# Altium schematic sheet ControL_24_LED_thuong_mai.SchDoc
size C
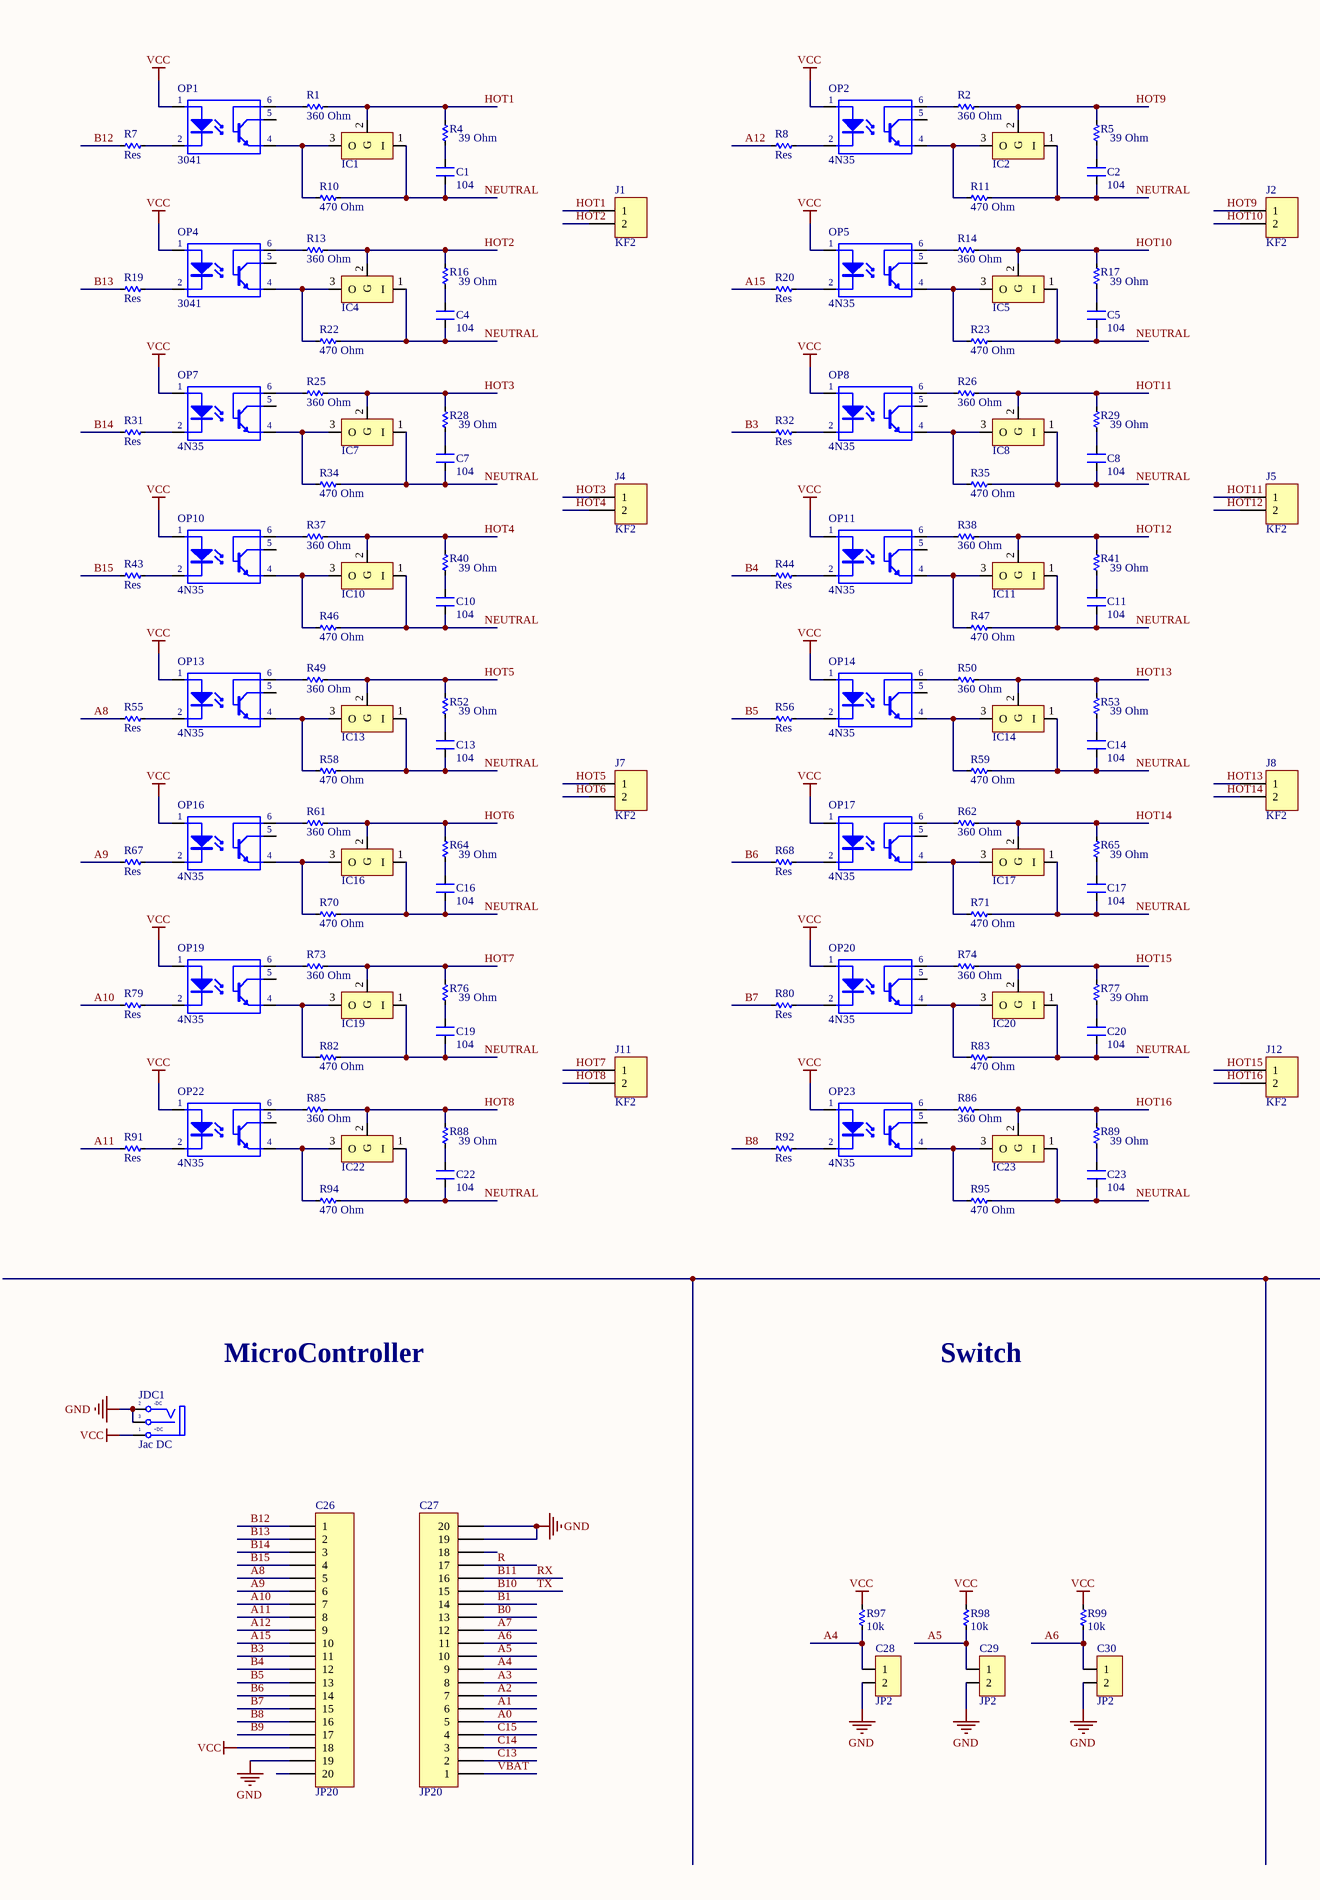
[diagram p0: ControL_24_LED_thuong_mai.SchDoc, left]
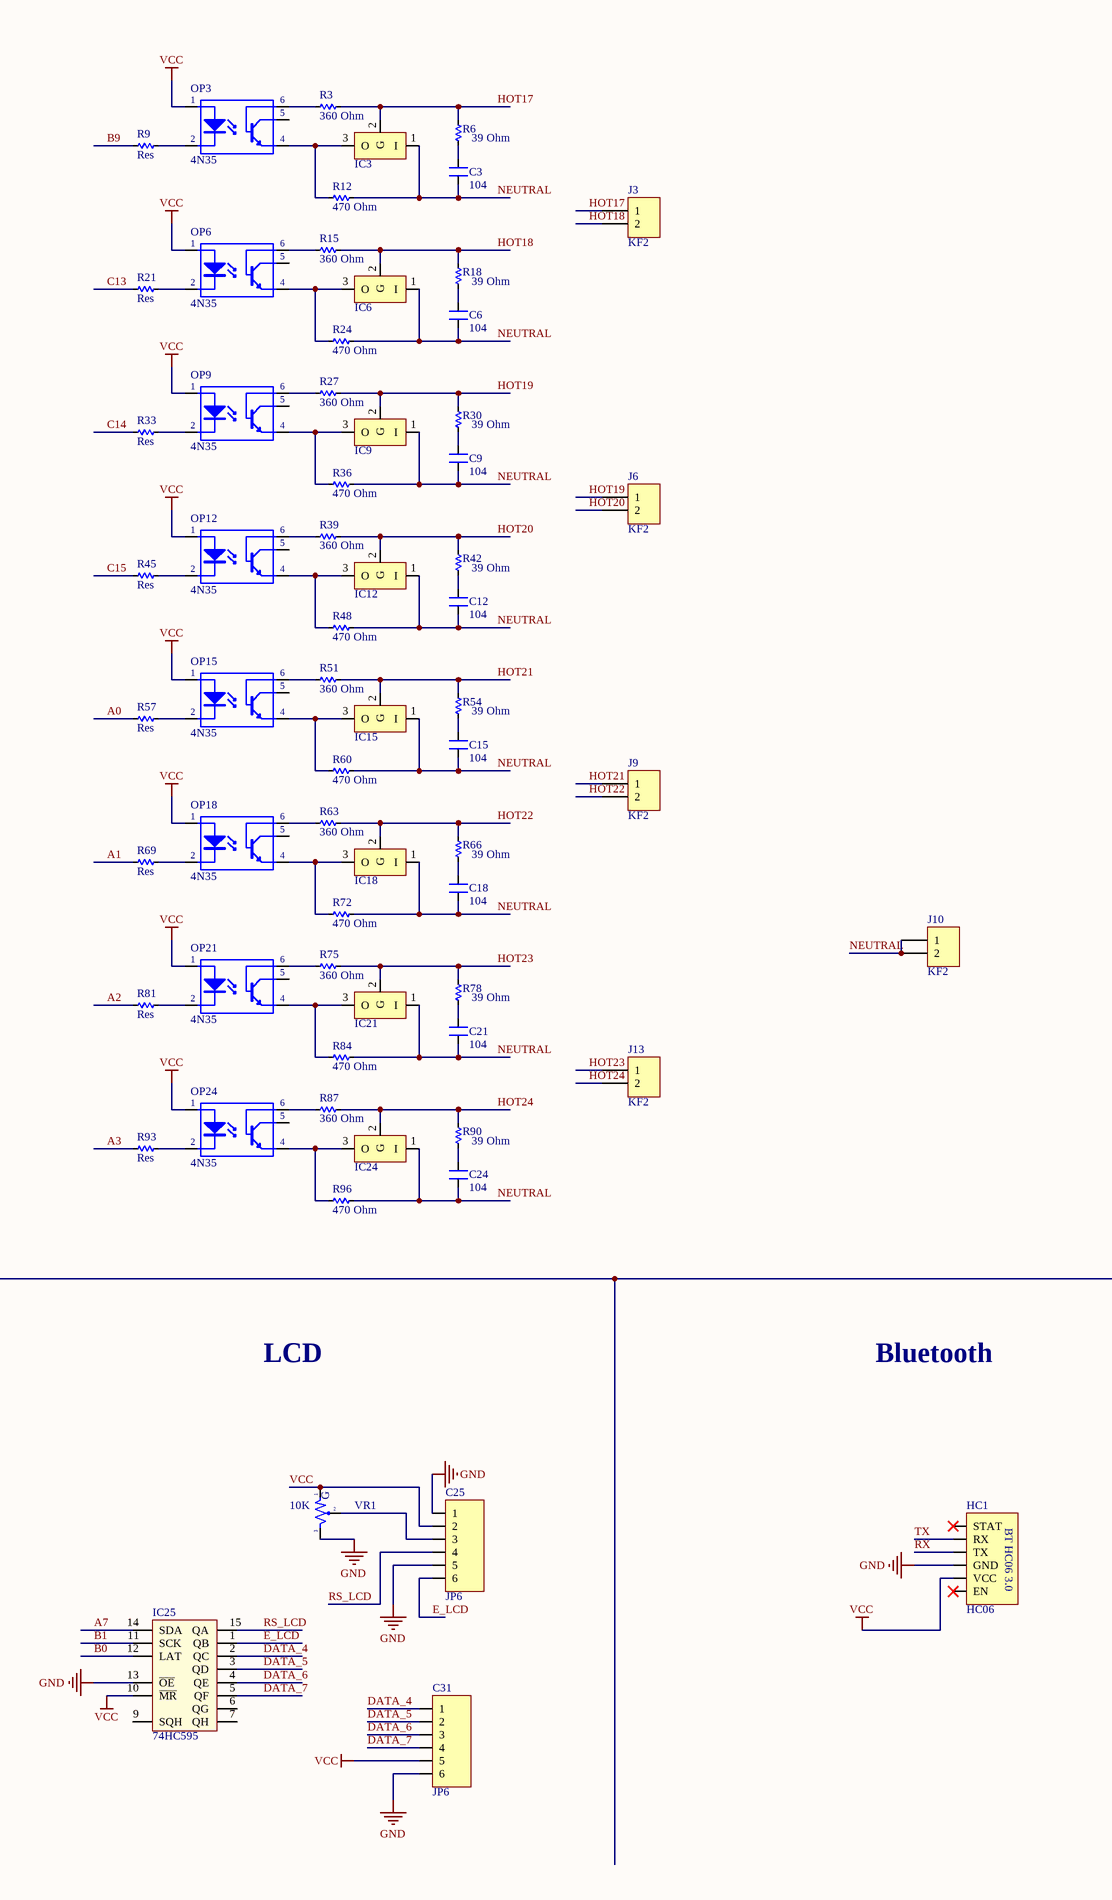
[diagram p1: ControL_24_LED_thuong_mai.SchDoc, right]

## Parts
C1  104  [SM-Cap-1206]
C2  104  [SM-Cap-1206]
C3  104  [SM-Cap-1206]
C4  104  [SM-Cap-1206]
C5  104  [SM-Cap-1206]
C6  104  [SM-Cap-1206]
C7  104  [SM-Cap-1206]
C8  104  [SM-Cap-1206]
C9  104  [SM-Cap-1206]
C10  104  [SM-Cap-1206]
C11  104  [SM-Cap-1206]
C12  104  [SM-Cap-1206]
C13  104  [SM-Cap-1206]
C14  104  [SM-Cap-1206]
C15  104  [SM-Cap-1206]
C16  104  [SM-Cap-1206]
C17  104  [SM-Cap-1206]
C18  104  [SM-Cap-1206]
C19  104  [SM-Cap-1206]
C20  104  [SM-Cap-1206]
C21  104  [SM-Cap-1206]
C22  104  [SM-Cap-1206]
C23  104  [SM-Cap-1206]
C24  104  [SM-Cap-1206]
C25  JP6  [JP6-D1T]
C26  JP20  [JP20-C1T]
C27  JP20  [JP20-C1T]
C28  JP2  [JP2-D1T]
C29  JP2  [JP2-D1T]
C30  JP2  [JP2-D1T]
C31  JP6  [JP6-D1T]
HC1  HC06  [HC06]
IC1  LM78xx  [TO252-123]  (value not drawn)
IC2  LM78xx  [TO252-123]  (value not drawn)
IC3  LM78xx  [TO252-123]  (value not drawn)
IC4  LM78xx  [TO252-123]  (value not drawn)
IC5  LM78xx  [TO252-123]  (value not drawn)
IC6  LM78xx  [TO252-123]  (value not drawn)
IC7  LM78xx  [TO252-123]  (value not drawn)
IC8  LM78xx  [TO252-123]  (value not drawn)
IC9  LM78xx  [TO252-123]  (value not drawn)
IC10  LM78xx  [TO252-123]  (value not drawn)
IC11  LM78xx  [TO252-123]  (value not drawn)
IC12  LM78xx  [TO252-123]  (value not drawn)
IC13  LM78xx  [TO252-123]  (value not drawn)
IC14  LM78xx  [TO252-123]  (value not drawn)
IC15  LM78xx  [TO252-123]  (value not drawn)
IC16  LM78xx  [TO252-123]  (value not drawn)
IC17  LM78xx  [TO252-123]  (value not drawn)
IC18  LM78xx  [TO252-123]  (value not drawn)
IC19  LM78xx  [TO252-123]  (value not drawn)
IC20  LM78xx  [TO252-123]  (value not drawn)
IC21  LM78xx  [TO252-123]  (value not drawn)
IC22  LM78xx  [TO252-123]  (value not drawn)
IC23  LM78xx  [TO252-123]  (value not drawn)
IC24  LM78xx  [TO252-123]  (value not drawn)
IC25  74HC595  [SO16]
J1  KF2  [KF2-7.62]
J2  KF2  [KF2-7.62]
J3  KF2  [KF2-7.62]
J4  KF2  [KF2-7.62]
J5  KF2  [KF2-7.62]
J6  KF2  [KF2-7.62]
J7  KF2  [KF2-7.62]
J8  KF2  [KF2-7.62]
J9  KF2  [KF2-7.62]
J10  KF2  [KF2-7.62]
J11  KF2  [KF2-7.62]
J12  KF2  [KF2-7.62]
J13  KF2  [KF2-7.62]
JDC1  Jac DC  [DC0]
OP1  3041  [SO6]
OP2  4N35  [SO6]
OP3  4N35  [SO6]
OP4  3041  [SO6]
OP5  4N35  [SO6]
OP6  4N35  [SO6]
OP7  4N35  [SO6]
OP8  4N35  [SO6]
OP9  4N35  [SO6]
OP10  4N35  [SO6]
OP11  4N35  [SO6]
OP12  4N35  [SO6]
OP13  4N35  [SO6]
OP14  4N35  [SO6]
OP15  4N35  [SO6]
OP16  4N35  [SO6]
OP17  4N35  [SO6]
OP18  4N35  [SO6]
OP19  4N35  [SO6]
OP20  4N35  [SO6]
OP21  4N35  [SO6]
OP22  4N35  [SO6]
OP23  4N35  [SO6]
OP24  4N35  [SO6]
R1  360 Ohm  [RES-SMD-1206]
R2  360 Ohm  [RES-SMD-1206]
R3  360 Ohm  [RES-SMD-1206]
R4  39 Ohm  [RES-SMD-1206]
R5  39 Ohm  [RES-SMD-1206]
R6  39 Ohm  [RES-SMD-1206]
R7  Res  [RES-SMD-0805]
R8  Res  [RES-SMD-0805]
R9  Res  [RES-SMD-0805]
R10  470 Ohm  [RES-SMD-1206]
R11  470 Ohm  [RES-SMD-1206]
R12  470 Ohm  [RES-SMD-1206]
R13  360 Ohm  [RES-SMD-1206]
R14  360 Ohm  [RES-SMD-1206]
R15  360 Ohm  [RES-SMD-1206]
R16  39 Ohm  [RES-SMD-1206]
R17  39 Ohm  [RES-SMD-1206]
R18  39 Ohm  [RES-SMD-1206]
R19  Res  [RES-SMD-0805]
R20  Res  [RES-SMD-0805]
R21  Res  [RES-SMD-0805]
R22  470 Ohm  [RES-SMD-1206]
R23  470 Ohm  [RES-SMD-1206]
R24  470 Ohm  [RES-SMD-1206]
R25  360 Ohm  [RES-SMD-1206]
R26  360 Ohm  [RES-SMD-1206]
R27  360 Ohm  [RES-SMD-1206]
R28  39 Ohm  [RES-SMD-1206]
R29  39 Ohm  [RES-SMD-1206]
R30  39 Ohm  [RES-SMD-1206]
R31  Res  [RES-SMD-0805]
R32  Res  [RES-SMD-0805]
R33  Res  [RES-SMD-0805]
R34  470 Ohm  [RES-SMD-1206]
R35  470 Ohm  [RES-SMD-1206]
R36  470 Ohm  [RES-SMD-1206]
R37  360 Ohm  [RES-SMD-1206]
R38  360 Ohm  [RES-SMD-1206]
R39  360 Ohm  [RES-SMD-1206]
R40  39 Ohm  [RES-SMD-1206]
R41  39 Ohm  [RES-SMD-1206]
R42  39 Ohm  [RES-SMD-1206]
R43  Res  [RES-SMD-0805]
R44  Res  [RES-SMD-0805]
R45  Res  [RES-SMD-0805]
R46  470 Ohm  [RES-SMD-1206]
R47  470 Ohm  [RES-SMD-1206]
R48  470 Ohm  [RES-SMD-1206]
R49  360 Ohm  [RES-SMD-1206]
R50  360 Ohm  [RES-SMD-1206]
R51  360 Ohm  [RES-SMD-1206]
R52  39 Ohm  [RES-SMD-1206]
R53  39 Ohm  [RES-SMD-1206]
R54  39 Ohm  [RES-SMD-1206]
R55  Res  [RES-SMD-0805]
R56  Res  [RES-SMD-0805]
R57  Res  [RES-SMD-0805]
R58  470 Ohm  [RES-SMD-1206]
R59  470 Ohm  [RES-SMD-1206]
R60  470 Ohm  [RES-SMD-1206]
R61  360 Ohm  [RES-SMD-1206]
R62  360 Ohm  [RES-SMD-1206]
R63  360 Ohm  [RES-SMD-1206]
R64  39 Ohm  [RES-SMD-1206]
R65  39 Ohm  [RES-SMD-1206]
R66  39 Ohm  [RES-SMD-1206]
R67  Res  [RES-SMD-0805]
R68  Res  [RES-SMD-0805]
R69  Res  [RES-SMD-0805]
R70  470 Ohm  [RES-SMD-1206]
R71  470 Ohm  [RES-SMD-1206]
R72  470 Ohm  [RES-SMD-1206]
R73  360 Ohm  [RES-SMD-1206]
R74  360 Ohm  [RES-SMD-1206]
R75  360 Ohm  [RES-SMD-1206]
R76  39 Ohm  [RES-SMD-1206]
R77  39 Ohm  [RES-SMD-1206]
R78  39 Ohm  [RES-SMD-1206]
R79  Res  [RES-SMD-0805]
R80  Res  [RES-SMD-0805]
R81  Res  [RES-SMD-0805]
R82  470 Ohm  [RES-SMD-1206]
R83  470 Ohm  [RES-SMD-1206]
R84  470 Ohm  [RES-SMD-1206]
R85  360 Ohm  [RES-SMD-1206]
R86  360 Ohm  [RES-SMD-1206]
R87  360 Ohm  [RES-SMD-1206]
R88  39 Ohm  [RES-SMD-1206]
R89  39 Ohm  [RES-SMD-1206]
R90  39 Ohm  [RES-SMD-1206]
R91  Res  [RES-SMD-0805]
R92  Res  [RES-SMD-0805]
R93  Res  [RES-SMD-0805]
R94  470 Ohm  [RES-SMD-1206]
R95  470 Ohm  [RES-SMD-1206]
R96  470 Ohm  [RES-SMD-1206]
R97  10k  [RES-SMD-0805]
R98  10k  [RES-SMD-0805]
R99  10k  [RES-SMD-0805]
VR1  10K  [VR-S3]

## Nets
GND: C25.1 C25.5 C26.19 C27.19 C27.20 C28.2 C29.2 C30.2 C31.6 HC1.4(GND) IC25.8(GND) IC25.13(~{OE}) JDC1.2(TN) JDC1.3(S) VR1.3
VCC: C25.2 C26.18 C31.5 HC1.5(VCC) IC25.10(~{MR}) IC25.16(VCC) JDC1.1(T) OP1.1(A) OP2.1(A) OP3.1(A) OP4.1(A) OP5.1(A) OP6.1(A) OP7.1(A) OP8.1(A) OP9.1(A) OP10.1(A) OP11.1(A) OP12.1(A) OP13.1(A) OP14.1(A) OP15.1(A) OP16.1(A) OP17.1(A) OP18.1(A) OP19.1(A) OP20.1(A) OP21.1(A) OP22.1(A) OP23.1(A) OP24.1(A) R97.1 R98.1 R99.1 VR1.1
A0: C27.5 R57.2
A1: C27.6 R69.2
A2: C27.7 R81.2
A3: C27.8 R93.2
A4: C27.9 C28.1 R97.2
A5: C27.10 C29.1 R98.2
A6: C27.11 C30.1 R99.2
A7: C27.12 IC25.14(SDA)
A8: C26.5 R55.2
A9: C26.6 R67.2
A10: C26.7 R79.2
A11: C26.8 R91.2
A12: C26.9 R8.2
A15: C26.10 R20.2
B0: C27.13 IC25.12(LAT)
B1: C27.14 IC25.11(SCK)
B3: C26.11 R32.2
B4: C26.12 R44.2
B5: C26.13 R56.2
B6: C26.14 R68.2
B7: C26.15 R80.2
B8: C26.16 R92.2
B9: C26.17 R9.2
B10: C27.15 HC1.2(RX)  [also labelled TX]
B11: C27.16 HC1.3(TX)  [also labelled RX]
B12: C26.1 R7.2
B13: C26.2 R19.2
B14: C26.3 R31.2
B15: C26.4 R43.2
C13: C27.2 R21.2
C14: C27.3 R33.2
C15: C27.4 R45.2
DATA_4: C31.1 IC25.2(QC)
DATA_5: C31.2 IC25.3(QD)
DATA_6: C31.3 IC25.4(QE)
DATA_7: C31.4 IC25.5(QF)
E_LCD: C25.6 IC25.1(QB)
HOT1: IC1.2(G) J1.1 R1.1 R4.1
HOT2: IC4.2(G) J1.2 R13.1 R16.1
HOT3: IC7.2(G) J4.1 R25.1 R28.1
HOT4: IC10.2(G) J4.2 R37.1 R40.1
HOT5: IC13.2(G) J7.1 R49.1 R52.1
HOT6: IC16.2(G) J7.2 R61.1 R64.1
HOT7: IC19.2(G) J11.1 R73.1 R76.1
HOT8: IC22.2(G) J11.2 R85.1 R88.1
HOT9: IC2.2(G) J2.1 R2.1 R5.1
HOT10: IC5.2(G) J2.2 R14.1 R17.1
HOT11: IC8.2(G) J5.1 R26.1 R29.1
HOT12: IC11.2(G) J5.2 R38.1 R41.1
HOT13: IC14.2(G) J8.1 R50.1 R53.1
HOT14: IC17.2(G) J8.2 R62.1 R65.1
HOT15: IC20.2(G) J12.1 R74.1 R77.1
HOT16: IC23.2(G) J12.2 R86.1 R89.1
HOT17: IC3.2(G) J3.1 R3.1 R6.1
HOT18: IC6.2(G) J3.2 R15.1 R18.1
HOT19: IC9.2(G) J6.1 R27.1 R30.1
HOT20: IC12.2(G) J6.2 R39.1 R42.1
HOT21: IC15.2(G) J9.1 R51.1 R54.1
HOT22: IC18.2(G) J9.2 R63.1 R66.1
HOT23: IC21.2(G) J13.1 R75.1 R78.1
HOT24: IC24.2(G) J13.2 R87.1 R90.1
NEUTRAL: C1.1 C2.1 C3.1 C4.1 C5.1 C6.1 C7.1 C8.1 C9.1 C10.1 C11.1 C12.1 C13.1 C14.1 C15.1 C16.1 C17.1 C18.1 C19.1 C20.1 C21.1 C22.1 C23.1 C24.1 IC1.1(I) IC2.1(I) IC3.1(I) IC4.1(I) IC5.1(I) IC6.1(I) IC7.1(I) IC8.1(I) IC9.1(I) IC10.1(I) IC11.1(I) IC12.1(I) IC13.1(I) IC14.1(I) IC15.1(I) IC16.1(I) IC17.1(I) IC18.1(I) IC19.1(I) IC20.1(I) IC21.1(I) IC22.1(I) IC23.1(I) IC24.1(I) J10.1 J10.2 R10.1 R11.1 R12.1 R22.1 R23.1 R24.1 R34.1 R35.1 R36.1 R46.1 R47.1 R48.1 R58.1 R59.1 R60.1 R70.1 R71.1 R72.1 R82.1 R83.1 R84.1 R94.1 R95.1 R96.1
R: C27.17
RS_LCD: C25.4 IC25.15(QA)
VBAT: C27.1
NetC1_2: C1.2 R4.2
NetC2_2: C2.2 R5.2
NetC3_2: C3.2 R6.2
NetC4_2: C4.2 R16.2
NetC5_2: C5.2 R17.2
NetC6_2: C6.2 R18.2
NetC7_2: C7.2 R28.2
NetC8_2: C8.2 R29.2
NetC9_2: C9.2 R30.2
NetC10_2: C10.2 R40.2
NetC11_2: C11.2 R41.2
NetC12_2: C12.2 R42.2
NetC13_2: C13.2 R52.2
NetC14_2: C14.2 R53.2
NetC15_2: C15.2 R54.2
NetC16_2: C16.2 R64.2
NetC17_2: C17.2 R65.2
NetC18_2: C18.2 R66.2
NetC19_2: C19.2 R76.2
NetC20_2: C20.2 R77.2
NetC21_2: C21.2 R78.2
NetC22_2: C22.2 R88.2
NetC23_2: C23.2 R89.2
NetC24_2: C24.2 R90.2
NetC25_3: C25.3 VR1.2
NetIC1_3: IC1.3(O) OP1.4(E) R10.2
NetIC2_3: IC2.3(O) OP2.4(E) R11.2
NetIC3_3: IC3.3(O) OP3.4(E) R12.2
NetIC4_3: IC4.3(O) OP4.4(E) R22.2
NetIC5_3: IC5.3(O) OP5.4(E) R23.2
NetIC6_3: IC6.3(O) OP6.4(E) R24.2
NetIC7_3: IC7.3(O) OP7.4(E) R34.2
NetIC8_3: IC8.3(O) OP8.4(E) R35.2
NetIC9_3: IC9.3(O) OP9.4(E) R36.2
NetIC10_3: IC10.3(O) OP10.4(E) R46.2
NetIC11_3: IC11.3(O) OP11.4(E) R47.2
NetIC12_3: IC12.3(O) OP12.4(E) R48.2
NetIC13_3: IC13.3(O) OP13.4(E) R58.2
NetIC14_3: IC14.3(O) OP14.4(E) R59.2
NetIC15_3: IC15.3(O) OP15.4(E) R60.2
NetIC16_3: IC16.3(O) OP16.4(E) R70.2
NetIC17_3: IC17.3(O) OP17.4(E) R71.2
NetIC18_3: IC18.3(O) OP18.4(E) R72.2
NetIC19_3: IC19.3(O) OP19.4(E) R82.2
NetIC20_3: IC20.3(O) OP20.4(E) R83.2
NetIC21_3: IC21.3(O) OP21.4(E) R84.2
NetIC22_3: IC22.3(O) OP22.4(E) R94.2
NetIC23_3: IC23.3(O) OP23.4(E) R95.2
NetIC24_3: IC24.3(O) OP24.4(E) R96.2
NetOP1_2: OP1.2(K) R7.1
NetOP1_6: OP1.6(C) R1.2
NetOP2_2: OP2.2(K) R8.1
NetOP2_6: OP2.6(C) R2.2
NetOP3_2: OP3.2(K) R9.1
NetOP3_6: OP3.6(C) R3.2
NetOP4_2: OP4.2(K) R19.1
NetOP4_6: OP4.6(C) R13.2
NetOP5_2: OP5.2(K) R20.1
NetOP5_6: OP5.6(C) R14.2
NetOP6_2: OP6.2(K) R21.1
NetOP6_6: OP6.6(C) R15.2
NetOP7_2: OP7.2(K) R31.1
NetOP7_6: OP7.6(C) R25.2
NetOP8_2: OP8.2(K) R32.1
NetOP8_6: OP8.6(C) R26.2
NetOP9_2: OP9.2(K) R33.1
NetOP9_6: OP9.6(C) R27.2
NetOP10_2: OP10.2(K) R43.1
NetOP10_6: OP10.6(C) R37.2
NetOP11_2: OP11.2(K) R44.1
NetOP11_6: OP11.6(C) R38.2
NetOP12_2: OP12.2(K) R45.1
NetOP12_6: OP12.6(C) R39.2
NetOP13_2: OP13.2(K) R55.1
NetOP13_6: OP13.6(C) R49.2
NetOP14_2: OP14.2(K) R56.1
NetOP14_6: OP14.6(C) R50.2
NetOP15_2: OP15.2(K) R57.1
NetOP15_6: OP15.6(C) R51.2
NetOP16_2: OP16.2(K) R67.1
NetOP16_6: OP16.6(C) R61.2
NetOP17_2: OP17.2(K) R68.1
NetOP17_6: OP17.6(C) R62.2
NetOP18_2: OP18.2(K) R69.1
NetOP18_6: OP18.6(C) R63.2
NetOP19_2: OP19.2(K) R79.1
NetOP19_6: OP19.6(C) R73.2
NetOP20_2: OP20.2(K) R80.1
NetOP20_6: OP20.6(C) R74.2
NetOP21_2: OP21.2(K) R81.1
NetOP21_6: OP21.6(C) R75.2
NetOP22_2: OP22.2(K) R91.1
NetOP22_6: OP22.6(C) R85.2
NetOP23_2: OP23.2(K) R92.1
NetOP23_6: OP23.6(C) R86.2
NetOP24_2: OP24.2(K) R93.1
NetOP24_6: OP24.6(C) R87.2

Not connected (* = marked no-connect by the designer): C26 20; C27 18; HC1 1(STAT)* 6(EN)*; IC25 6(QG) 7(QH) 9(SQH); OP1 5(C); OP2 5(C); OP3 5(C); OP4 5(C); OP5 5(C); OP6 5(C); OP7 5(C); OP8 5(C); OP9 5(C); OP10 5(C); OP11 5(C); OP12 5(C); OP13 5(C); OP14 5(C); OP15 5(C); OP16 5(C); OP17 5(C); OP18 5(C); OP19 5(C); OP20 5(C); OP21 5(C); OP22 5(C); OP23 5(C); OP24 5(C)

## Notes on the sheet
- MicroController
- Switch
- LCD
- Bluetooth
- (in symbol DCIN) -DC; +DC
- (in symbol HC06) BT HC06 3.0
- (in symbol VR-S) G

## Library data of the parts
C1-C24 = CN: Value: 0,1uF/300V; Designed by: VanDungEvn
C25 C31 = JP6: WR-PHD 2.54 mm Angled Socket Header; Manufacturer: W¨¹rth Elektronik eiSos GmbH; partNo: 613006143121; ComponentLink1 Description: Manufacturer; ComponentLink2 Description: Datasheet; NoPins: 06; Created Date: 29 March 2013; ComponentLink1URL: http://www.we-online.com; ComponentLink2URL: http://katalog.we-online.de/em/datasheet/6130xx143121.pdf; Created by: Karrer Zheng
C26 C27 = JP20: WR-PHD 2.54 mm Angled Socket Header; Manufacturer: W¨¹rth Elektronik eiSos GmbH; partNo: 613020143121; ComponentLink1 Description: Manufacturer; ComponentLink2 Description: Datasheet; NoPins: 20; Created Date: 29 March 2013; ComponentLink1URL: http://www.we-online.com; ComponentLink2URL: http://katalog.we-online.de/em/datasheet/6130xx143121.pdf; Created by: Karrer Zheng
C28-C30 = JP2: WR-PHD 2.54 mm Angled Socket Header; Manufacturer: W¨¹rth Elektronik eiSos GmbH; partNo: 613002143121; ComponentLink1 Description: Manufacturer; ComponentLink2 Description: Datasheet; NoPins: 02; Created Date: 29 March 2013; ComponentLink1URL: http://www.we-online.com; ComponentLink2URL: http://katalog.we-online.de/em/datasheet/6130xx143121.pdf; Created by: Karrer Zheng
HC1 = HC06: Manufacturer: W¨¹rth Elektronik eiSos GmbH; partNo: 613004143121; ComponentLink1 Description: Manufacturer; ComponentLink2 Description: Datasheet; NoPins: 04; Created Date: 29 March 2013; ComponentLink1URL: http://www.we-online.com; ComponentLink2URL: http://katalog.we-online.de/em/datasheet/6130xx143121.pdf; Created by: Karrer Zheng
IC1-IC24 = LM78xx: Positive Voltage Regulator; Note: Tab is connected to pin 3 (GND).; Published: 24-Aug-2001; LatestRevisionDate: 17-Jul-2002; LatestRevisionNote: Re-released for DXP Platform.; DatasheetVersion: Apr-1994; PackageVersion: Jul-1998; PackageReference: ISOWATT220AB; Publisher: Altium Limited; PackageDescription: TO, Thru-Hole, Vertical, Heatsink Mounted; 3 In-Line Leads; Pitch 2.54 mm; Pin sequence 1, 3, 2; ComponentLink1Description: Manufacturer Link; ComponentLink1URL: http://www.st.com/; ComponentLink2Description: Datasheet; ComponentLink2URL: http://www.st.com/stonline/products/literature/ds/2146/l78m05c.pdf
IC25 = 74595: 8 Bit Serial input - Parallel Output; Value: 74HC595
J1-J13 = KF2: Manufacturer: Würth Elektronik eiSos GmbH; partNo: 691103110002; ComponentLink1 Description: Manufacturer; ComponentLink2 Description: Datasheet; NoPins: 2; Created Date: 29 October 2013; ComponentLink1URL: http://www.we-online.com; ComponentLink2URL: http://katalog.we-online.de/em/datasheet/6911031100xx.pdf; Created by: Karrer Zheng
JDC1 = DCIN: Jac DC input; Value: Jac DC
OP1 OP4 = 4N35: Opto; Value: 4N35
OP2 OP3 OP5-OP24 = 4N35: Opto; Value: 4N35
R1-R99 = Res-SMD: Resistor; Manufacturer: Generic Components; Class: Passive; Published: 08/06/2000; Publisher: Altium Hobart Technology Centre
VR1 = VR-S: Var Resistor; Value: Volume 50k